# Altium project TMR_RAD_COMPARE.PrjPcb
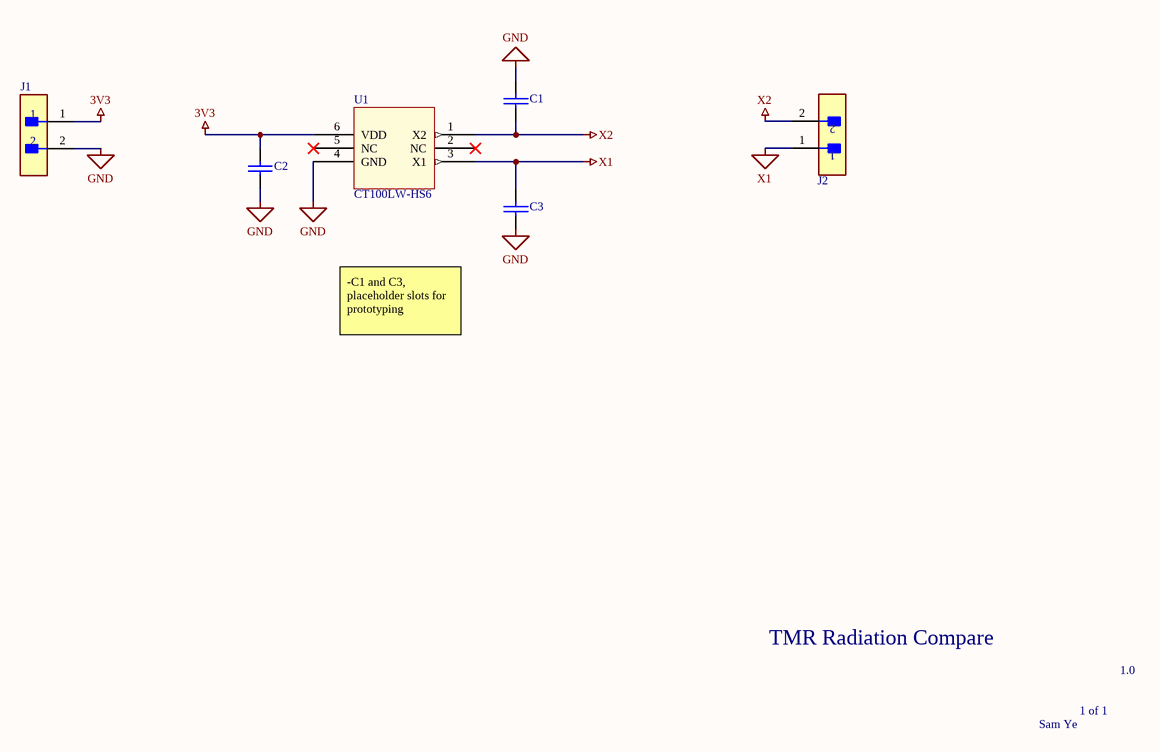
[diagram p0: TMR_RAD_COMPARE.SchDoc]
1 sheet, 6 parts. Net scope: global (net labels, ports and power ports of the same name join across sheets).
Board file: TMR_RAD_COMPARE.PcbDoc

## Sheet TMR_RAD_COMPARE.SchDoc
size A4; SheetNumber: 1; SheetTotal: 1

### Parts
C1  *  [0805 CAP]  (value not drawn)
C2  *  [0805 CAP]  (value not drawn)
C3  *  [0805 CAP]  (value not drawn)
J1  M20-9990245  [FP-M20-9990245-MFG]  (value not drawn)
J2  M20-9990245  [FP-M20-9990245-MFG]  (value not drawn)
U1  CT100LW-HS6  [CT100LW-HS6-Footprint-1]

### Nets
3V3: C2.1 J1.1 U1.6(VDD)
GND: C1.1 C2.2 C3.2 J1.2 U1.4(GND)
X1: C3.1 J2.1 U1.3(X1)
X2: C1.2 J2.2 U1.1(X2)

Not connected (* = marked no-connect by the designer): U1 2(NC)* 5(NC)*

### Notes on the sheet
- -C1 and C3, placeholder slots for prototyping
- TMR Radiation Compare
- 1 of 1
- 1.0
- Sam Ye

### Library data of the parts
C1-C3 = CerCap_SMT_0805: SMT ceramic capacitor 0805 size; Value: *
J1 J2 = CMP-15831-000105-1: CONN HEADER VERT 2POS 2.54MM; Working Voltage: 750V; Gender: Male; Number of Poles: 2; Current Rating: 3A; Mated Stacking Heights: 16.54mm; Contact Resistance: 25mR; Connector Type: Male Pin; Insulation Resistance: 10GR; Mating Cycles: 300; Voltage: 50V; Flammability Rating: UL94 V-0; Pitch: 2.54mm; Series: M20; Number of Contacts: 2; Height: 0.12inch; Min Operating Temperature: -40°C; Contact Finish - Mating: GOLD; Number of Positions: 2; Number of Rows: 1; Packaging: Bulk; Package Quantity: 1000; Voltage Rating (AC): 750V; Current: 3A; Mount: Through Hole; Case/Package: SIL; Orientation: Straight; Contact Shape: Square; Weight: 0.25lb; Radiation Hardening: No; Fastening Type: Pull; Length: 5.08mm; Depth: 2.54mm; Contact Mating Length: 0.24inch; Housing Material: Nylon; Reach SVHC Compliant: Yes; Insulation Material: Nylon; Color: Black; Width: 0.25inch; Insulation Color: Black; Contact Material: Brass; Contact Type: Male Pin; Termination: Solder; Max Operating Temperature: 105°C; Contact Plating: Gold; Housing Color: Black; Max Current Rating: 3A; Lead Pitch: 2.54mm
U1 = CMP-010-00004-1: Magnetoresistive Sensor, -50mT Min, 50mT Max, -1.43-1.43V, Rectangular, 6 Pin, Surface Mount; Min Supply Voltage: 1V; Max Supply Voltage: 5.5V; Max Operating Temperature: 125°C; REACH SVHC: Yes; Introduction Date: 2023-11-30; RoHS: Compliant; Number of Terminals: 6; Height: 1.1mm; Lifecycle Status: Production; Min Operating Temperature: -40°C; Mounting Technology: Surface Mount; Length: 2.9mm